# EAGLE design Chiqoo3 (EAGLE 6.6.0)
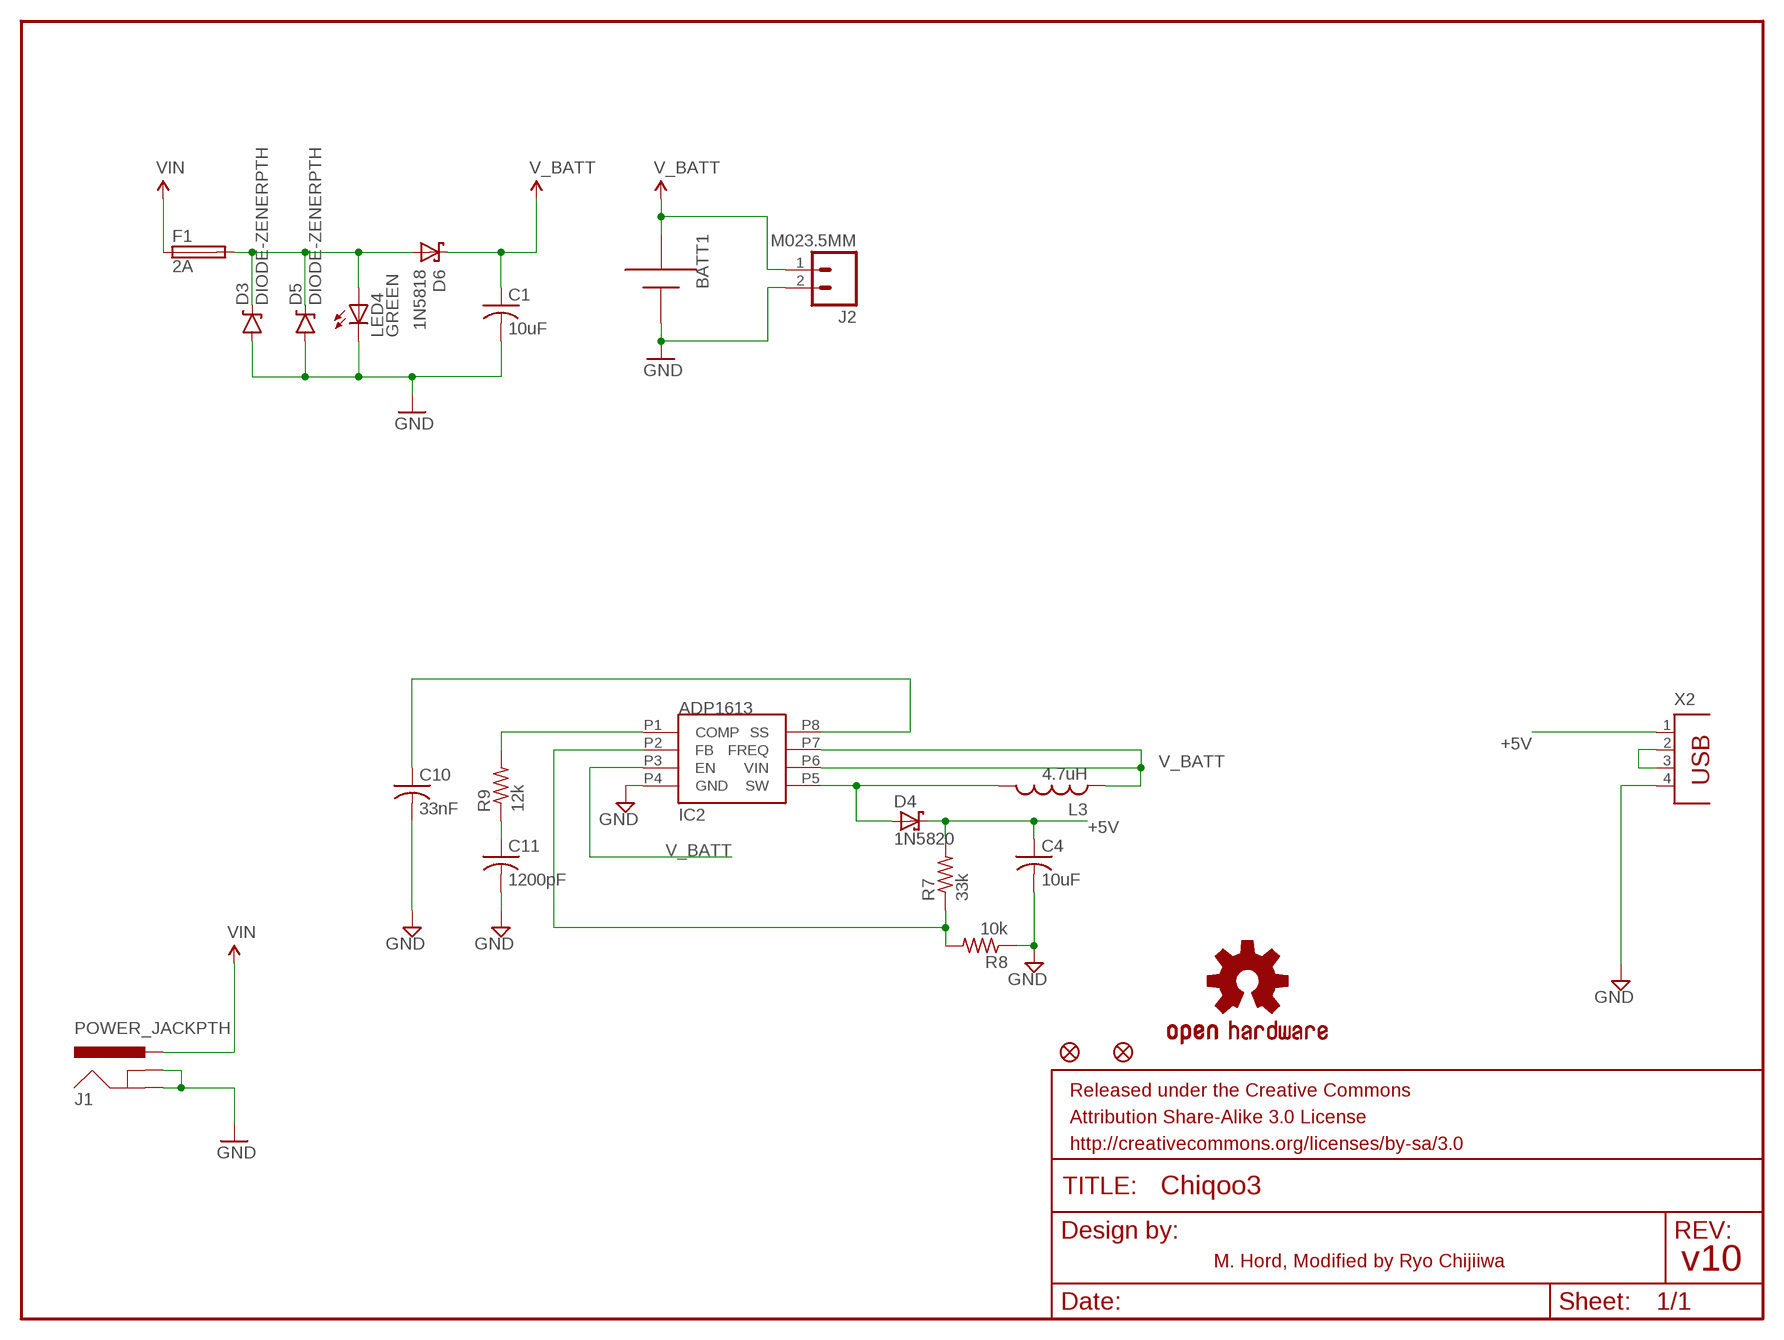
[diagram p0: schematic, sheet 1]

## Parts
BATT1  18650-HOLDER  [BK-18650-PC2]
C1  10uF  C-US050-024X044  [C050-024X044]
C4  10uF  C-US050-024X044  [C050-024X044]
C10  33nF  C-US050-024X044  [C050-024X044]
C11  1200pF  C-US025-025X050  [C025-025X050]
D3  DIODE-ZENERPTH  [DIODE-ZENER]
D4  1N5820  SCHOTTKY-DIODE  [DIODE]
D5  DIODE-ZENERPTH  [DIODE-ZENER]
D6  1N5818  SCHOTTKY-DIODEDIODE-5  [DIODE-5]
F1  2A  TE5  [TE5]
FID1  FIDUCIAL1X2  [FIDUCIAL-1X2]
FID2  FIDUCIAL1X2  [FIDUCIAL-1X2]
FRAME1  FRAME-LETTER  [CREATIVE_COMMONS]
IC2  ADP1613  [RM-8]
J1  POWER_JACKPTH  [POWER_JACK_PTH]
J2  M023.5MM  [SCREWTERMINAL-3.5MM-2]
L3  4.7uH  L-5MM-THRUHOLE  [L-5MM-THRUHOLE]
LED4  GREEN  LED3MM  [LED3MM]
LOGO2  OSHW-LOGOM  [OSHW-LOGO-M]
R7  33k  R-US_0204/5  [0204/5]
R8  10k  R-US_0204/5  [0204/5]
R9  12k  R-US_0204/5  [0204/5]
X2  PN87520  [PN87520]

## Nets
5V1: D4.ANNODE(A) IC2.P5(SW) L3.2
+5V: C4.1 D4.CATHODE(C) R7.2 X2.1
GND: BATT1.-(--) C1.2 C4.2 C10.2 C11.2 D3.P$2(A) D5.P$2(A) IC2.P4(GND) J1.GND J1.GNDBREAK J2.2 LED4.K(C) R8.1 X2.4
N$4: IC2.P1(COMP) R9.2
N$6: X2.2 X2.3
N$8: C11.1 R9.1
N$9: IC2.P2(FB) R7.1 R8.2
N$10: C10.1 IC2.P8(SS)
N$12: D3.P$1(C) D5.P$1(C) D6.A F1.2 LED4.A
V_BATT: BATT1.+(++) C1.1 D6.C IC2.P3(EN) IC2.P6(VIN) IC2.P7(FREQ) J2.1 L3.1
VIN: F1.1 J1.PWR

## Notes on the sheet
- M. Hord, Modified by Ryo Chijiiwa | v10

## Library data of the parts
BATT1 = bootstrapsolar:18650-HOLDER: 18650 holder
C1 C4 = adafruit:C-US: CAPACITOR, American symbol
C10 C11 = resistor:C-US: CAPACITOR, American symbol
D3 D5 = SparkFun-DiscreteSemi:DIODE-ZENER: Zener Diode Production Part - 8199 3.4V Zener Voltage
D4 D6 = bootstrapsolar:SCHOTTKY-DIODE: Schottky diode. 1N5820 to 1N5822. 1.4mm holes spaced 12mm apart.
F1 = fuse:TE5: FUSE Wickmann; OC_FARNELL: unknown; OC_NEWARK: unknown
FID1 FID2 = SparkFun-Aesthetics:FIDUCIAL: Fiducial Alignment Points Various fiducial points for machine vision alignment.
FRAME1 = SparkFun-Aesthetics:FRAME-LETTER: Schematic Frame Standard 8.5x11 US Letter frame
IC2 = bootstrapsolar:ADP1613
J1 = SparkFun-Connectors:POWER_JACK: Power Jack This is the standard 5.5mm barrel jack for power. The PTH is the most common, proven, reliable, footprint. The Slot footprint only works if the mill layer is transmitted to the PCB fab house so be warned. Spark Fun Electronics SKU : PRT-00119 SMT: CONN-08106 Mating wall wart : TOL-00298 (and others)
J2 = SparkFun-Connectors:M02: Standard 2-pin 0.1" header. Use with - straight break away headers ( PRT-00116) - right angle break away headers (PRT-00553) - swiss pins (PRT-00743) - machine pins (PRT-00117) - female headers (PRT-00115) Molex polarized connector foot print use with: PRT-08233 with associated crimp pins and housings. 2.54_SCREWTERM for use with PRT-10571. 3.5mm Screw Terminal footprints for PRT-08084 5mm Screw Terminal footprints for use with PRT-08433
L3 = bootstrapsolar:L-5MM-THRUHOLE: Inductor, thru hole. 5mm between pins, 9mm radius.
LED4 = adafruit:LED: LED OSRAM: - CHIPLED LG R971, LG N971, LY N971, LG Q971, LY Q971, LO R971, LY R971 LH N974, LH R974 LS Q976, LO Q976, LY Q976 LO Q996 - Hyper CHIPLED LW Q18S LB Q993, LB Q99A, LB R99A - SideLED LS A670, LO A670, LY A670, LG A670, LP A670 LB A673, LV A673, LT A673, LW A673 LH A674 LY A675 LS A676, LA A676, LO A676, LY A676, LW A676 LS A679, LY A679, LG A679 - Hyper Micro SIDELED® LS Y876, LA Y876, LO Y876, LY Y876 LT Y87S - SmartLED LW L88C, LW L88S LB L89C, LB L89S, LG L890 LS L89K, LO L89K, LY L89K LS L896, LA L896, LO L896, LY L896 - TOPLED LS T670, LO T670, LY T670, LG T670, LP T670 LSG T670, LSP T670, LSY T670, LOP T670, LYG T670 LG T671, LOG T671, LSG T671 LB T673, LV T673, LT T673, LW T673 LH T674 LS T676, LA T676, LO T676, LY T676, LB T676, LH T676, LSB T676, LW T676 LB T67C, LV T67C, LT T67C, LS T67K, LO T67K, LY T67K, LW E67C LS E67B, LA E67B, LO E67B, LY E67B, LB E67C, LV E67C, LT E67C LW T67C LS T679, LY T679, LG T679 LS T770, LO T770, LY T770, LG T770, LP T770 LB T773, LV T773, LT T773, LW T773 LH T774 LS E675, LA E675, LY E675, LS T675 LS T776, LA T776, LO T776, LY T776, LB T776 LHGB T686 LT T68C, LB T68C - Hyper Mini TOPLED® LB M676 - Mini TOPLED Santana® LG M470 LS M47K, LO M47K, LY M47K Source: http://www.osram.convergy.de/
LOGO2 = SparkFun-Aesthetics:OSHW-LOGO: Open Source Hardware Logo This logo indicates the piece of hardware it is found on incorporates a OSHW license and/or adheres to the definition of open source hardware found here: http://freedomdefined.org/OSHW
R7-R9 = adafruit:R-US_: RESISTOR, American symbol
X2 = bootstrapsolar:PN87520: BERG USB connector; OC_FARNELL: unknown; OC_NEWARK: unknown

## Board
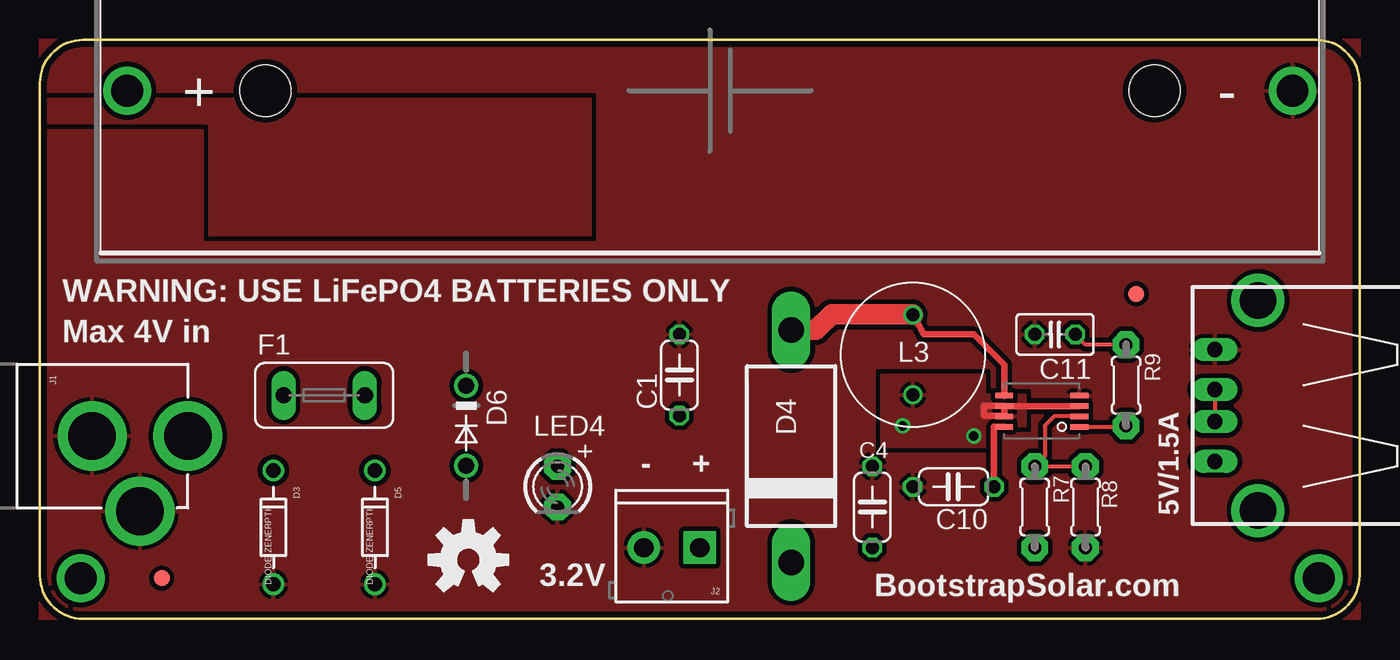
[diagram p1: board, top side]
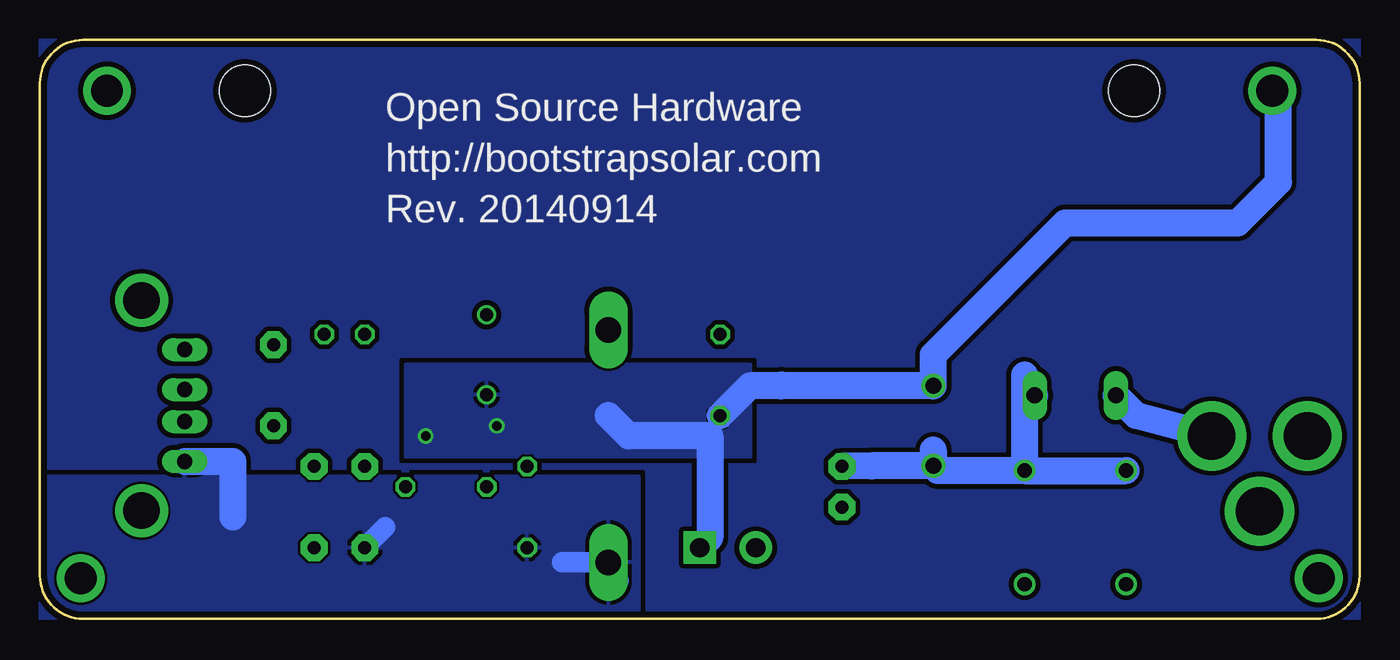
[diagram p2: board, bottom side, seen from below]

Size 82.55 x 36.2 mm. Coordinates in mm from the lower left corner, seen from the top.
Outline: 0,2.69 0,33.5 arc-90 2.69,36.2 79.86,36.2 arc-90 82.55,33.5 82.55,2.69 arc-90 79.86,0 2.69,0 arc-90 0,2.69
Copper layers (1*16): Top 0.0356mm / dielectric 1.5011mm / Bottom 0.0356mm
Design rules "LaenPCBOrder": minimum track width 6mil, minimum drill 13mil, track to track 6mil, track to pad 6mil, pad to pad 6mil, via to via 6mil, smd to smd 6mil, copper to edge 15mil, drill to drill 6mil, minimum pad ring 7mil, minimum via ring 7mil, stop-mask expansion 3mil, vias tented up to drill 0mil, thermal gap 10mil

### Footprints (pad centres in the part's own frame; a part is rotated, then mirrored left to right if it is on the bottom)
BK-18650-PC2 = drill 2: + -36.449,0; - 36.449,0 | hole 3.2: -27.813,0; 27.813,0
C050-024X044 = drill 0.813 octagon: 1 -2.54,0; 2 2.54,0
C025-025X050 = drill 0.813 octagon: 1 -1.27,0; 2 1.27,0
DIODE-ZENER = drill 0.9: P$1 -3.556,0; P$2 3.556,0
DIODE = drill 1.6 long: ANNODE -7.27,0; CATHODE 7.27,0
DIODE-5 = drill 1: A 2.5,0; C -2.5,0
TE5 = drill 1.016 long: 1 -2.54,0; 2 2.54,0
FIDUCIAL-1X2 = smd 1 x 1: 1 0,0
RM-8 = smd 1.1 x 0.35: P1 -4.7,0.7; P2 -4.7,0.05; P3 -4.7,-0.6; P4 -4.7,-1.25; P5 0,-1.25; P6 0,-0.6; P7 0,0.05; P8 0,0.7
POWER_JACK_PTH = drill 2.997 pad 4.318: GND 0,7.7; GNDBREAK 4.7,10.7; PWR 0,13.7
SCREWTERMINAL-3.5MM-2 = drill 1.2 pad 2.032 square: 1 0,0 | drill 1.2 pad 2.032: 2 3.5,0
L-5MM-THRUHOLE = drill 0.8: 1 -2.5,0; 2 2.5,0
LED3MM = drill 0.813 pad 1.676 octagon: A -1.27,0; K 1.27,0
0204/5 = drill 0.813 pad 1.676 octagon: 1 -2.54,0; 2 2.54,0
PN87520 = drill 0.95 long: 1 -3.5,2.71; 2 -1,2.71; 3 1,2.71; 4 3.5,2.71 | drill 2.3: P$1 -6.57,0; P$2 -6.57,0; P$3 6.57,0

### Placement (x,y rotation side)
BATT1  41.91,33.02 0 top
C1  40.01,15.24 90 top
C4  52.07,6.99 90 top
C10  57.15,8.26 180 top
C11  63.5,17.78 180 top
D3  14.61,5.71 270 top
D4  46.99,10.79 270 top
D5  20.95,5.71 270 top
D6  26.67,12.06 270 top
F1  17.78,13.97 0 top
FID1  7.62,2.54 0 top
FID2  68.58,20.32 0 top
FRAME1  46.99,-26.67 0 top  (outside the outline)
IC2  60.33,12.7 180 top
J1  -4.45,11.43 270 top
J2  41.27,4.45 180 top
L3  54.61,16.51 90 top
LED4  32.38,8.26 270 top
LOGO2  26.8,3.68 0 top
R7  62.23,6.99 270 top
R8  65.41,6.99 90 top
R9  67.94,14.61 270 top
X2  76.2,13.34 90 top

### Tracks (layer width: path | path; a pad name or v marks a point on that pad's centre or on a via)
5V1
  Top 0.406: IC2.P5 60.33,15.88 58.42,17.78 55.28,17.78 L3.2
  Top 1.27: D4.ANNODE 48.55,18.07 49.53,19.05 54.57,19.05 L3.2
+5V
  Bottom 1.27: 49.88,3.52 D4.CATHODE 46.35,2.38 | 60.96,5.71 R7.2
  Bottom 1.676: X2.1 70.48,9.84 70.48,6.35
  pour Bottom: 45.09,8.89 82.55,8.89 82.55,0 45.09,0
BOTTOM
  pour Bottom (isolate 0.305, rank 3, no thermals): 0,36.2 82.55,36.2 82.55,0 0,0
GND
  pour Top (isolate 0.305, rank 2): 82.55,36.2 0,36.2 0,33.02 34.92,33.02 34.92,23.5 10.16,23.5 10.16,30.48 0,30.48 0,0 82.55,0
N$1
  pour Top (isolate 0.305, rank 3, no thermals): 0,36.2 82.55,36.2 82.55,0 0,0
N$2  (via drill 2)
  other vias: 80.01,2.54
N$3  (via drill 2)
  other vias: 2.54,2.54
N$4
  Top 0.254: IC2.P1 67.88,12 R9.2
N$6
  Top 0.254: X2.3 X2.2
N$8
  Top 0.254: R9.1 65.41,17.14 C11.1
N$9
  Top 0.254: R8.2 R7.1 62.87,10.16 62.87,12.06 63.45,12.65 IC2.P2
N$10
  Top 0.406: IC2.P8 59.69,12 C10.1
N$12
  Bottom 1.676: F1.2 20.95,15.24 D5.P$1 | D5.P$1 D3.P$1 | 26.67,10.54 D6.A | D6.A 30.52,9.56 LED4.A | D5.P$1 26.38,9.27 D6.A
V_BATT  (via drill 0.6)
  Top 0.406: IC2.P3 IC2.P6 | 60.33,13.34 60.33,12.7 59.05,12.7 59.05,13.34 60.33,13.34
  Bottom 1.676: BATT1.+ 5.08,32.64 5.08,27.3 7.62,24.77 18.41,24.77 26.67,16.51 D6.C 36.2,14.56 | J2.1 40.64,5.08 40.64,11.43 45.72,11.43 46.99,12.7 | 36.16,14.61 36.2,14.56 | 36.2,14.56 38.14,14.56 C1.1
  other vias: 58.42,11.43 53.98,12.06
  pour Top (isolate 0.305): 61.59,12.06 59.05,12.06 59.05,10.79 52.7,10.79 52.7,15.24 59.05,15.24 59.05,13.97 61.59,13.97
  pour Bottom: 38.1,15.88 59.69,15.88 59.69,10.16 38.1,10.16
VIN
  Bottom 1.676: J1.PWR 13.97,12.7 F1.1

### Text on the board
tPlace: WARNING: USE LiFePO4 BATTERIES ONLY | Max 4V in | - | + | 5V/1.5A | 3.2V | BootstrapSolar.com
bPlace: Open Source Hardware | http://bootstrapsolar.com | Rev. 20140914
tDocu: M. Hord, Modified by R. Chijiiwa